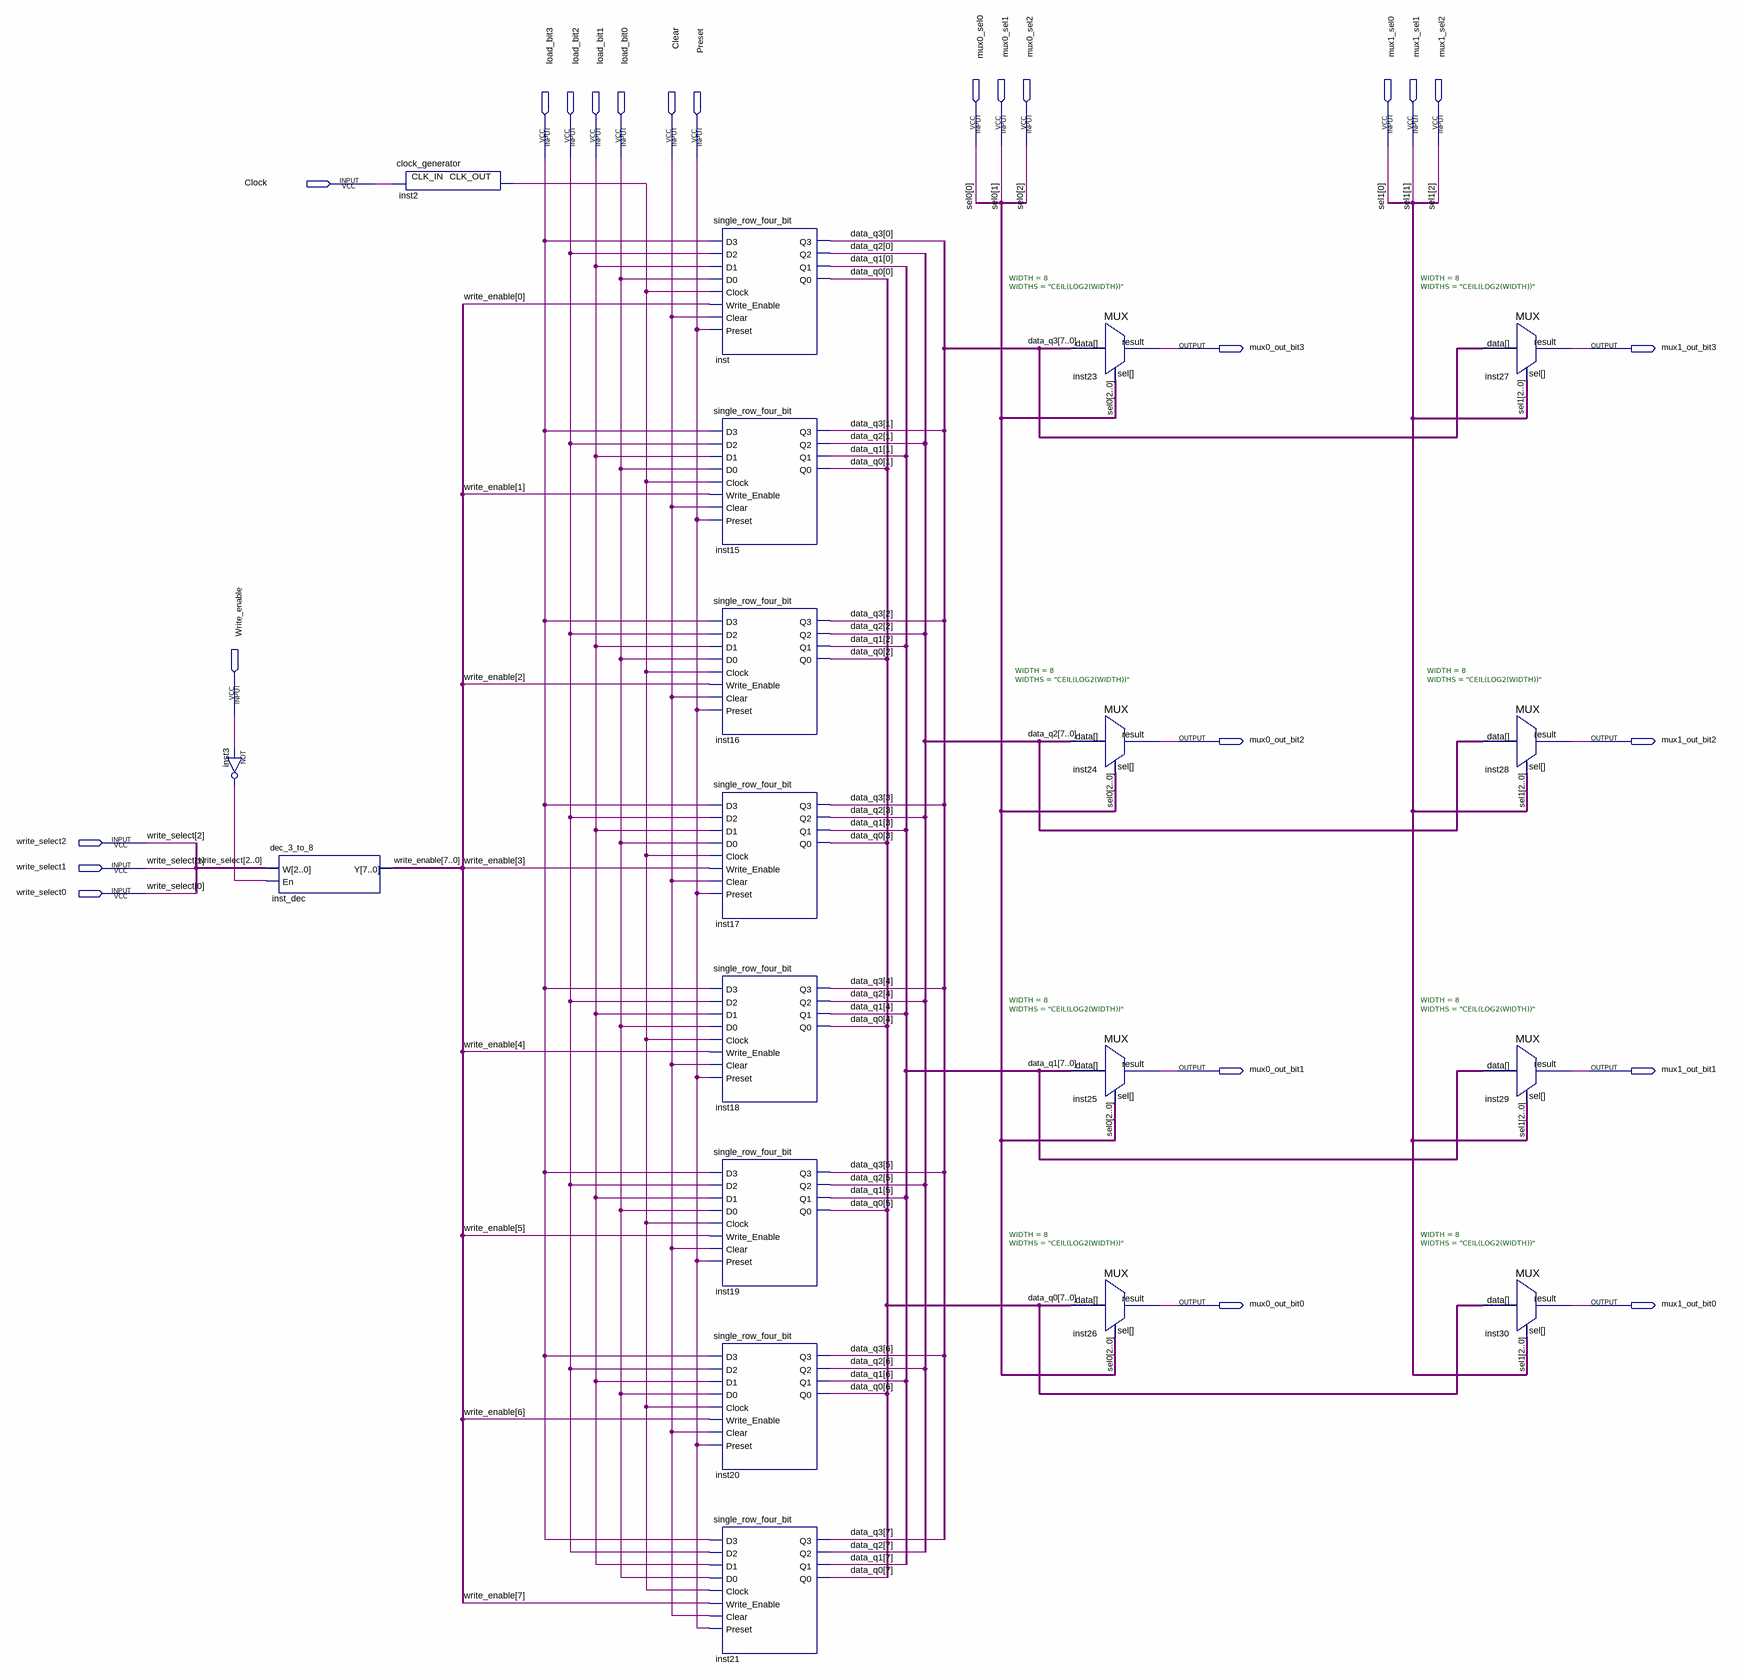
[diagram p0: schematic sheet]
// Quartus schematic reg_file.bdf as structural Verilog: 19 symbols, 25 pins
module reg_file (
  input  mux0_sel0,
  input  mux0_sel1,
  input  mux0_sel2,
  input  mux1_sel0,
  input  mux1_sel1,
  input  mux1_sel2,
  input  load_bit3,
  input  load_bit2,
  input  load_bit1,
  input  load_bit0,
  input  Clear,
  input  Preset,
  input  Clock,
  input  Write_enable,
  input  write_select2,
  input  write_select1,
  input  write_select0,
  output mux0_out_bit3,
  output mux1_out_bit3,
  output mux0_out_bit2,
  output mux1_out_bit2,
  output mux0_out_bit1,
  output mux1_out_bit1,
  output mux0_out_bit0,
  output mux1_out_bit0
);

  wire inst2_clk_out, inst3_out;
  wire [7:0] data_q0, data_q1, data_q2, data_q3, Write_enable_bus;

  not inst3 (inst3_out, Write_enable);
  dec_3_to_8 inst_dec (.W({write_select2, write_select1, write_select0}), .En(inst3_out), .Y(Write_enable_bus));
  clock_generator inst2 (.CLK_IN(Clock), .CLK_OUT(inst2_clk_out));
  single_row_four_bit inst (
    .D3(load_bit3), .D2(load_bit2), .D1(load_bit1), .D0(load_bit0), .Clock(inst2_clk_out),
    .Write_Enable(Write_enable_bus[0]), .Clear(Clear), .Preset(Preset), .Q3(data_q3[0]), .Q2(data_q2[0]),
    .Q1(data_q1[0]), .Q0(data_q0[0]));
  single_row_four_bit inst15 (
    .D3(load_bit3), .D2(load_bit2), .D1(load_bit1), .D0(load_bit0), .Clock(inst2_clk_out),
    .Write_Enable(Write_enable_bus[1]), .Clear(Clear), .Preset(Preset), .Q3(data_q3[1]), .Q2(data_q2[1]),
    .Q1(data_q1[1]), .Q0(data_q0[1]));
  single_row_four_bit inst16 (
    .D3(load_bit3), .D2(load_bit2), .D1(load_bit1), .D0(load_bit0), .Clock(inst2_clk_out),
    .Write_Enable(Write_enable_bus[2]), .Clear(Clear), .Preset(Preset), .Q3(data_q3[2]), .Q2(data_q2[2]),
    .Q1(data_q1[2]), .Q0(data_q0[2]));
  single_row_four_bit inst17 (
    .D3(load_bit3), .D2(load_bit2), .D1(load_bit1), .D0(load_bit0), .Clock(inst2_clk_out),
    .Write_Enable(Write_enable_bus[3]), .Clear(Clear), .Preset(Preset), .Q3(data_q3[3]), .Q2(data_q2[3]),
    .Q1(data_q1[3]), .Q0(data_q0[3]));
  single_row_four_bit inst18 (
    .D3(load_bit3), .D2(load_bit2), .D1(load_bit1), .D0(load_bit0), .Clock(inst2_clk_out),
    .Write_Enable(Write_enable_bus[4]), .Clear(Clear), .Preset(Preset), .Q3(data_q3[4]), .Q2(data_q2[4]),
    .Q1(data_q1[4]), .Q0(data_q0[4]));
  single_row_four_bit inst19 (
    .D3(load_bit3), .D2(load_bit2), .D1(load_bit1), .D0(load_bit0), .Clock(inst2_clk_out),
    .Write_Enable(Write_enable_bus[5]), .Clear(Clear), .Preset(Preset), .Q3(data_q3[5]), .Q2(data_q2[5]),
    .Q1(data_q1[5]), .Q0(data_q0[5]));
  single_row_four_bit inst20 (
    .D3(load_bit3), .D2(load_bit2), .D1(load_bit1), .D0(load_bit0), .Clock(inst2_clk_out),
    .Write_Enable(Write_enable_bus[6]), .Clear(Clear), .Preset(Preset), .Q3(data_q3[6]), .Q2(data_q2[6]),
    .Q1(data_q1[6]), .Q0(data_q0[6]));
  single_row_four_bit inst21 (
    .D3(load_bit3), .D2(load_bit2), .D1(load_bit1), .D0(load_bit0), .Clock(inst2_clk_out),
    .Write_Enable(Write_enable_bus[7]), .Clear(Clear), .Preset(Preset), .Q3(data_q3[7]), .Q2(data_q2[7]),
    .Q1(data_q1[7]), .Q0(data_q0[7]));
  MUX #(.WIDTH(8), .WIDTHS("CEIL(LOG2(WIDTH))")) inst23 (
    .data(data_q3), .sel({mux0_sel2, mux0_sel1, mux0_sel0}), .result(mux0_out_bit3));
  MUX #(.WIDTH(8), .WIDTHS("CEIL(LOG2(WIDTH))")) inst24 (
    .data(data_q2), .sel({mux0_sel2, mux0_sel1, mux0_sel0}), .result(mux0_out_bit2));
  MUX #(.WIDTH(8), .WIDTHS("CEIL(LOG2(WIDTH))")) inst25 (
    .data(data_q1), .sel({mux0_sel2, mux0_sel1, mux0_sel0}), .result(mux0_out_bit1));
  MUX #(.WIDTH(8), .WIDTHS("CEIL(LOG2(WIDTH))")) inst26 (
    .data(data_q0), .sel({mux0_sel2, mux0_sel1, mux0_sel0}), .result(mux0_out_bit0));
  MUX #(.WIDTH(8), .WIDTHS("CEIL(LOG2(WIDTH))")) inst27 (
    .data(data_q3), .sel({mux1_sel2, mux1_sel1, mux1_sel0}), .result(mux1_out_bit3));
  MUX #(.WIDTH(8), .WIDTHS("CEIL(LOG2(WIDTH))")) inst28 (
    .data(data_q2), .sel({mux1_sel2, mux1_sel1, mux1_sel0}), .result(mux1_out_bit2));
  MUX #(.WIDTH(8), .WIDTHS("CEIL(LOG2(WIDTH))")) inst29 (
    .data(data_q1), .sel({mux1_sel2, mux1_sel1, mux1_sel0}), .result(mux1_out_bit1));
  MUX #(.WIDTH(8), .WIDTHS("CEIL(LOG2(WIDTH))")) inst30 (
    .data(data_q0), .sel({mux1_sel2, mux1_sel1, mux1_sel0}), .result(mux1_out_bit0));

  // Other names for the same wires on the sheet: sel0[2:0] = {mux0_sel2, mux0_sel1, mux0_sel0};
  //   sel1[2:0] = {mux1_sel2, mux1_sel1, mux1_sel0}
endmodule
